# Altium project Display.PrjPCB
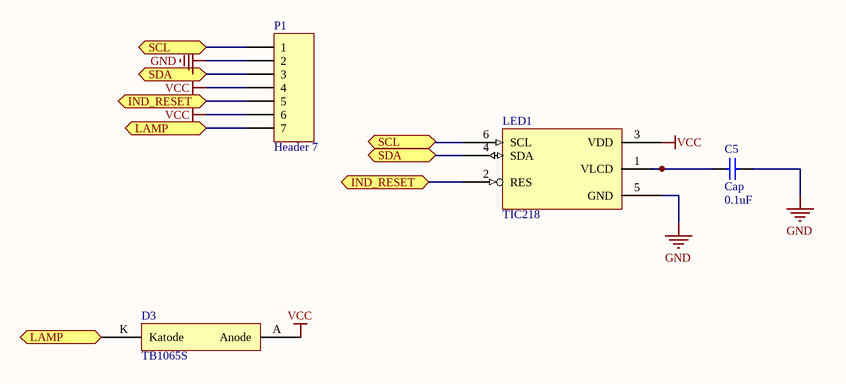
[diagram p0: Dispaly.SchDoc]
1 sheet, 4 parts. Net scope: flat (ports and power ports of the same name join across sheets).
Board file: Display.PcbDoc

## Sheet Dispaly.SchDoc
size A2

### Parts
C5  Cap  value 0.1uF  [CAPC3225L]
D3  TB1065S  [TB1065S]
LED1  TIC218  [TIC218]
P1  Header 7  [HDR1X7]

### Ports
IND_RESET (bidir), LAMP, SCL (bidir), SDA (bidir)

### Nets
GND: C5.2 LED1.5(GND) LED1.7(GND) P1.2
VCC: D3.A(Anode) LED1.3(VDD) P1.4 P1.6
NetC5_1: C5.1 LED1.1(VLCD)
NetD3_K: D3.K(Katode) P1.7 ; port LAMP
NetLED1_2: LED1.2(RES) P1.5 ; port IND_RESET
NetLED1_4: LED1.4(SDA) P1.3 ; port SDA
NetLED1_6: LED1.6(SCL) P1.1 ; port SCL

### Library data of the parts
C5 = Cap: Capacitor; Published: 8-Jun-2000; LatestRevisionDate: 17-Jul-2002; LatestRevisionNote: Re-released for DXP Platform.; PackageReference: RAD-0.3; Publisher: Altium Limited
D3 = TB1065S: Подсветка диодная для индикатора TIC218
P1 = Header 7: Header, 7-Pin; LatestRevisionDate: 17-Jul-2002; LatestRevisionNote: Re-released for DXP Platform.; Publisher: Altium Limited